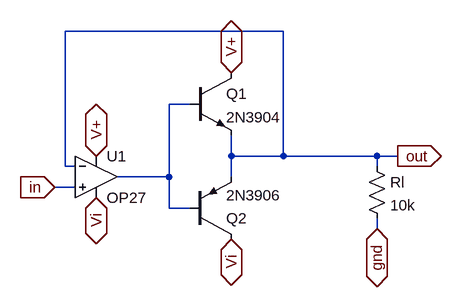
[diagram p0: schematic power_transformer.asc]
power_transformer.asc, the LTspice schematic file:
Version 4.1
SHEET 1 880 680
WIRE 336 64 0 64
WIRE 192 176 160 176
WIRE 256 256 256 224
WIRE 336 256 336 64
WIRE 336 256 256 256
WIRE 480 256 336 256
WIRE 512 256 480 256
WIRE 0 272 0 64
WIRE 16 272 0 272
WIRE 480 272 480 256
WIRE 160 288 160 176
WIRE 160 288 80 288
WIRE 256 288 256 256
WIRE 16 304 -16 304
WIRE 160 336 160 288
WIRE 192 336 160 336
WIRE 480 368 480 352
FLAG 256 128 V+
IOPIN 256 128 BiDir
FLAG 48 256 V+
IOPIN 48 256 BiDir
FLAG 256 384 Vi
IOPIN 256 384 BiDir
FLAG 48 320 Vi
IOPIN 48 320 BiDir
FLAG 480 368 gnd
IOPIN 480 368 BiDir
FLAG -16 304 in
IOPIN -16 304 In
FLAG 512 256 out
IOPIN 512 256 Out
SYMBOL OpAmps\\OP27 48 224 R0
SYMATTR InstName U1
SYMBOL npn 192 128 R0
SYMATTR InstName Q1
SYMATTR Value 2N3904
SYMBOL pnp 192 384 M180
SYMATTR InstName Q2
SYMATTR Value 2N3906
SYMBOL res 464 256 R0
SYMATTR InstName Rl
SYMATTR Value 10k

The netlist it stands for:
* power_transformer.asc
X§U1 in out V+ Vi N001 OP27  ; pins In+ In- V+ V- OUT
Q1 V+ N001 out 0 2N3904
Q2 Vi N001 out 0 2N3906
Rl out gnd 10k
.model NPN NPN
.model PNP PNP
.lib standard.bjt
.lib ADI.lib
.backanno
.end